# Altium schematic sheet Poactuator_Connectors.SchDoc: Sample Sheet Title
size B; Date: MM/DD/YYYY; Author: Sample Author; Organization: ORGANIZATION; Address1: ADDRESS 1; Address2: ADDRESS 2; Address3: ADDRESS 3; Address4: ADDRESS 4; Revision: -; SheetNumber: 1; SheetTotal: 6; ENG_APP_DATE: --/--/--; DSN_APP_DATE: --/--/--; CHK_APP_DATE: --/--/--
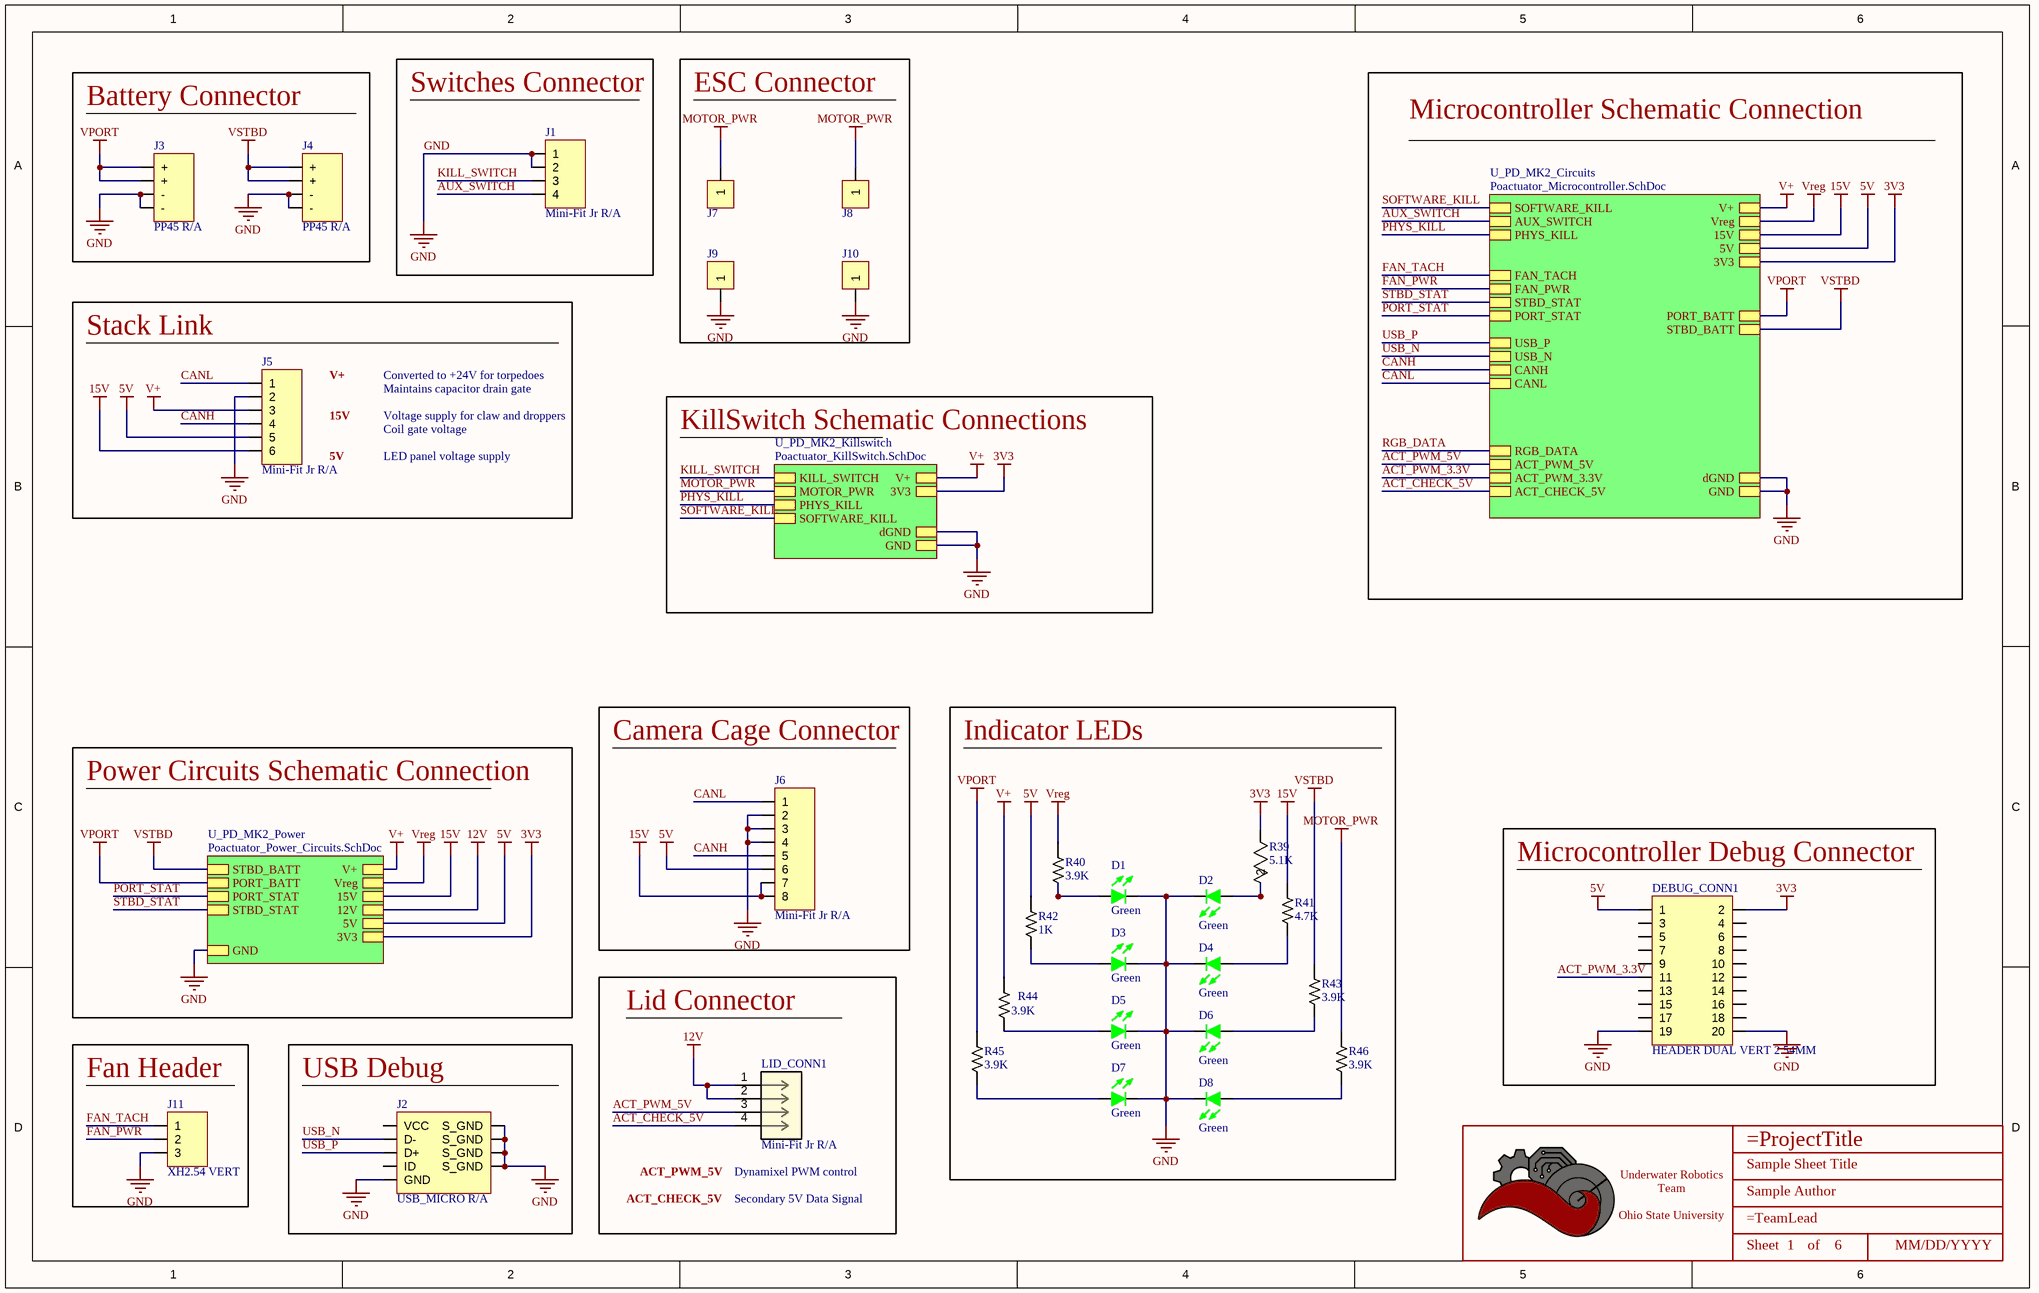
[diagram p0: Poactuator_Connectors.SchDoc]

## Parts
*  Title_Block  [LOGO]  (value not drawn)  (graphical)
D1  Color: Green  [LED_0603]  (hidden comment: IN-S63AT5G)
D2  Color: Green  [LED_0603]  (hidden comment: IN-S63AT5G)
D3  Color: Green  [LED_0603]  (hidden comment: IN-S63AT5G)
D4  Color: Green  [LED_0603]  (hidden comment: IN-S63AT5G)
D5  Color: Green  [LED_0603]  (hidden comment: IN-S63AT5G)
D6  Color: Green  [LED_0603]  (hidden comment: IN-S63AT5G)
D7  Color: Green  [LED_0603]  (hidden comment: IN-S63AT5G)
D8  Color: Green  [LED_0603]  (hidden comment: IN-S63AT5G)
DEBUG_CONN1  HEADER DUAL VERT 2.54MM  [HEADER_2x10PIN_2.54MM]
J1  Mini-Fit Jr R/A  [CONN_MOLEX_MINIFIT JR_4 POS_R/A]
J2  USB_MICRO R/A  [CONN_MINIUSB]
J3  PP45 R/A  [CONN_ANDERSON_PP45_4 POS_R/A]
J4  PP45 R/A  [CONN_ANDERSON_PP45_4 POS_R/A]
J5  Mini-Fit Jr R/A  [CONN_MOLEX_MINIFIT JR_6 POS_R/A]
J6  Mini-Fit Jr R/A  [CONN_MOLEX_MINIFIT JR_8 POS_R/A]
J7  Redcube M4 Term 85A  [Redcube M4 Term 85A]  (value not drawn)
J8  Redcube M4 Term 85A  [Redcube M4 Term 85A]  (value not drawn)
J9  Redcube M4 Term 85A  [Redcube M4 Term 85A]  (value not drawn)
J10  Redcube M4 Term 85A  [Redcube M4 Term 85A]  (value not drawn)
J11  XH2.54 VERT  [CONN_JST_XH254_3POS_VERT]
LID_CONN1  Mini-Fit Jr R/A  [CONN HEADER R/A 4POS 4.2MM]
R39  5.1K  [RC0603N_PAN]
R40  Value  (Ohms): 3.9K  [RESISTOR_0603]  (hidden comment: 3.9k Ohm 5% 1/10W)
R41  Value  (Ohms): 4.7K  [RESISTOR_0603]  (hidden comment: 4.7k Ohm 5% 1/10W)
R42  Value  (Ohms): 1K  [RESISTOR_0603]  (hidden comment: 1k Ohm 5% 1/8W)
R43  Value  (Ohms): 3.9K  [RESISTOR_0603]  (hidden comment: 3.9k Ohm 5% 1/10W)
R44  Value  (Ohms): 3.9K  [RESISTOR_0603]  (hidden comment: 3.9k Ohm 5% 1/10W)
R45  Value  (Ohms): 3.9K  [RESISTOR_0603]  (hidden comment: 3.9k Ohm 5% 1/10W)
R46  Value  (Ohms): 3.9K  [RESISTOR_0603]  (hidden comment: 3.9k Ohm 5% 1/10W)

## Blocks framed on the sheet
Switches Connector: J1
ESC Connector: J7-J10
Battery Connector: J3 J4
Stack Link: J5
Camera Cage Connector: J6
Indicator LEDs: D1-D8 R39-R46
Microcontroller Debug Connector: DEBUG_CONN1
Lid Connector: LID_CONN1
Fan Header: J11
USB Debug: J2

## Sub-sheets
U_PD_MK2_Circuits = Poactuator_Microcontroller.SchDoc: GND, V+, 5V, 3V3, SOFTWARE_KILL, AUX_SWITCH, FAN_TACH, FAN_PWR, 15V, dGND, Vreg, STBD_STAT, PORT_STAT, USB_P, USB_N, STBD_BATT, CANH, CANL, PORT_BATT, RGB_DATA, ACT_PWM_5V, ACT_PWM_3.3V, ACT_CHECK_5V, PHYS_KILL
U_PD_MK2_Killswitch = Poactuator_KillSwitch.SchDoc: KILL_SWITCH, MOTOR_PWR, V+, 3V3, dGND, GND, PHYS_KILL, SOFTWARE_KILL
U_PD_MK2_Power = Poactuator_Power_Circuits.SchDoc: STBD_BATT, PORT_BATT, GND, V+, 15V, 5V, 3V3, PORT_STAT, STBD_STAT, Vreg, 12V

## Nets
3V3: DEBUG_CONN1.2 R39.1 ; sheet U_PD_MK2_Power/3V3, sheet U_PD_MK2_Circuits/3V3, sheet U_PD_MK2_Killswitch/3V3
5V: DEBUG_CONN1.1 J5.5 J6.6 R42.1 ; sheet U_PD_MK2_Power/5V, sheet U_PD_MK2_Circuits/5V
12V: LID_CONN1.1 LID_CONN1.2 ; sheet U_PD_MK2_Power/12V
15V: J5.6 J6.7 J6.8 R41.1 ; sheet U_PD_MK2_Power/15V, sheet U_PD_MK2_Circuits/15V
GND: D1.2 D2.2 D3.2 D4.2 D5.2 D6.2 D7.2 D8.2 DEBUG_CONN1.19 DEBUG_CONN1.20 J1.1 J1.2 J2.5(GND) J2.6(S_GND) J2.7(S_GND) J2.8(S_GND) J2.9(S_GND) J3.3(-) J3.4(-) J4.3(-) J4.4(-) J5.2 J6.2 J6.3 J6.4 J9.1 J10.1 J11.3 ; sheet U_PD_MK2_Power/GND, sheet U_PD_MK2_Circuits/GND, sheet U_PD_MK2_Circuits/dGND, sheet U_PD_MK2_Killswitch/dGND, sheet U_PD_MK2_Killswitch/GND
MOTOR_PWR: J7.1 J8.1 R46.1 ; sheet U_PD_MK2_Killswitch/MOTOR_PWR
V+: J5.3 R44.1 ; sheet U_PD_MK2_Power/V+, sheet U_PD_MK2_Circuits/V+, sheet U_PD_MK2_Killswitch/V+
VPORT: J3.1(+) J3.2(+) R45.1 ; sheet U_PD_MK2_Power/PORT_BATT, sheet U_PD_MK2_Circuits/PORT_BATT
Vreg: R40.1 ; sheet U_PD_MK2_Power/Vreg, sheet U_PD_MK2_Circuits/Vreg
VSTBD: J4.1(+) J4.2(+) R43.1 ; sheet U_PD_MK2_Power/STBD_BATT, sheet U_PD_MK2_Circuits/STBD_BATT
ACT_CHECK_5V: LID_CONN1.4 ; sheet U_PD_MK2_Circuits/ACT_CHECK_5V
ACT_PWM_3.3V: DEBUG_CONN1.11 ; sheet U_PD_MK2_Circuits/ACT_PWM_3.3V
ACT_PWM_5V: LID_CONN1.3 ; sheet U_PD_MK2_Circuits/ACT_PWM_5V
AUX_SWITCH: J1.4 ; sheet U_PD_MK2_Circuits/AUX_SWITCH
CANH: J5.4 J6.5 ; sheet U_PD_MK2_Circuits/CANH
CANL: J5.1 J6.1 ; sheet U_PD_MK2_Circuits/CANL
FAN_PWR: J11.2 ; sheet U_PD_MK2_Circuits/FAN_PWR
FAN_TACH: J11.1 ; sheet U_PD_MK2_Circuits/FAN_TACH
KILL_SWITCH: J1.3 ; sheet U_PD_MK2_Killswitch/KILL_SWITCH
PHYS_KILL: sheet U_PD_MK2_Circuits/PHYS_KILL, sheet U_PD_MK2_Killswitch/PHYS_KILL
PORT_STAT: sheet U_PD_MK2_Power/PORT_STAT, sheet U_PD_MK2_Circuits/PORT_STAT
RGB_DATA: sheet U_PD_MK2_Circuits/RGB_DATA
SOFTWARE_KILL: sheet U_PD_MK2_Circuits/SOFTWARE_KILL, sheet U_PD_MK2_Killswitch/SOFTWARE_KILL
STBD_STAT: sheet U_PD_MK2_Power/STBD_STAT, sheet U_PD_MK2_Circuits/STBD_STAT
USB_N: J2.2(D-) ; sheet U_PD_MK2_Circuits/USB_N
USB_P: J2.3(D+) ; sheet U_PD_MK2_Circuits/USB_P
NetD1_1: D1.1 R40.2
NetD2_1: D2.1 R39.2
NetD3_1: D3.1 R42.2
NetD4_1: D4.1 R41.2
NetD5_1: D5.1 R44.2
NetD6_1: D6.1 R43.2
NetD7_1: D7.1 R45.2
NetD8_1: D8.1 R46.2

Not connected (* = marked no-connect by the designer): DEBUG_CONN1 3 4 5 6 7 8 9 10 12 13 14 15 16 17 18; J2 1(VCC) 4(ID)

## Notes on the sheet
- Microcontroller Schematic Connection
- V+
- 15V
- Converted to +24V for torpedoes
- Voltage supply for claw and droppers
- Coil gate voltage
- Maintains capacitor drain gate
- KillSwitch Schematic Connections
- 5V
- LED panel voltage supply
- Power Circuits Schematic Connection
- ACT_PWM_5V
- (near LID_CONN1) Dynamixel PWM control
- ACT_CHECK_5V
- Secondary 5V Data Signal
- DWG. NO.
- REV.
- SHT.
- THIS DOCUMENT AND THE DATA DISCLOSED HEREIN OR HEREWITH IS THE PROPERTY OF ALTIUM LIMITED AND MAY BE FREELY DISTRIBUTED IN WHOLE. NO RIGHTS ARE RESERVED OR EXPRESS OR IMPLIED WARANTEE GIVEN.
- REVISION
- DESCRIPTION
- DATE
- APPROVED
- ENG:
- APPROVALS
- PROJECT
- DSN:
- CHK:
- REFERENCE DOCUMENTS
- PROJECT REVISION:
- TITLE
- DOCUMENT REVISION:
- DESIGN ITEM:
- BOM:
- FAB DWG:
- PCB DWG:
- ASSY DWG:
- SCALE:
- SIZE
- B
- CAGE CODE
- FILE NAME
- DWG NO.
- SHEET
- OF
- REV
- (in symbol Title_Block) Underwater Robotics Team / Ohio State University; Sheet; of

## Library data of the parts
* = Title_Block: UWRT Schematic Title Block Template / Created June 2021, Dylan Trainor
D1-D8 = LED_Green_0603_3V: LED Green Vf= 3V If = 0.005A / IN-S63AT5G; Made By: Robert Pafford; Forward Current: 5mA; ComponentLink1Description: Datasheet; ComponentLink1URL: https://www.we-online.de/katalog/datasheet/150060GS75000.pdf; Forward Voltage: 3V; Package: 0603; Supplier 1: Digi-Key; Supplier Part Number 1: 1830-1062-1-ND
DEBUG_CONN1 = HEADER_2x10PIN_2.54MM: CONN HEADER VERT 20POS 2.54MM; Made By: Tyson Nguyen; Supplier 1: Digi-Key; Supplier Part Number 1: Z8747-ND
J1 = CONN_MOLEX_MINIFIT JR_4POS_R/A: Molex Minifit Jr. 5569 / 4 Pos R/A Natural; Pitch: 4.2mm; Configuration: Right Angle; Current Per Pin: 13A; Number of Positions: 4; Supplier Part Number 1: WM13112-ND; Supplier 1: Digi-Key; Manufacturer: Molex; Color: Natural; Created By: Flip B; ComponentLink1Description: Datasheet; ComponentLink1URL: https://www.molex.com/pdm_docs/sd/026013115_sd.pdf; Series: Minifit Jr 5569
J2 = CONN_MICROUSB: Amphenol Micro USB-B / USB2.0 5 Pin Right Angle SMD; Pitch: 0.65mm; Current Per Pin: 1.8A; Number of Positions: 5; Manufacturer: Amphenol; Configuration: Right Angle; Color: Silver; Created By: Flip B; ComponentLink1Description: Datasheet; ComponentLink1URL: https://cdn.amphenol-icc.com/media/wysiwyg/files/documentation/datasheet/inputoutput/io_usb_micro.pdf?__cf_chl_jschl_tk__=05693735e19256298f6ef6ca2bb2e65c376a4f56-1625503833-0-Abitsb0-ufjOXJYs_S3J3r2iTn-nObalbmXUksF1VvO_h_WEmRdMlUD1I8-hmWSEVWzY1pirKnrPZWfgY3851qyBZe5ZvnNQePLGIzUgdEIQBVUyW36RsbYpDLEWxJ4horD-5gChFgobLYqwmG5aHl0E8lIn_twwPPrOxilK2gP0q9t_CNOs_u5fMqXvXUrlsOv8tIE2NRlu6NVP8qtkL2GjhlkeTUbDMF8WvvpPDTFOgvZ4Y16Ej8F8AhWos88mo5B1HssXozw0XrkJQIqERITUu6rqloz9kf4ZzhBHtDAt-IkiAFY_Ds9SW8FYKKTtINJVpHZQ6Gyu1FFM4Dc9MO0maE8_mmNcwlxqyRoRk_MPWW8VyByXWM5RSp52jteRKw7FeI9WIYvCbPAOy0Eyib-aseIQsnGbglBcUY6_2xp8GYaJM38H3dNvBPsSOfJBPndKedwKHllxjkucXn6xsN0sDXkpGN-cu8_2bDTJ0g-uUucKSCooYX-ApSDNGpkA_p9zv1SOAD8c0zaZVmtiBsN75QpVz2rzq9_BFxOywPvR; Series: 10118192; Supplier 1: Digi-Key; Supplier Part Number 1: 609-4613-1-ND
J3 J4 = CONN_ANDERSON_2x2_R/A: Anderson PP45 / 4 Pos R/A Red/Black; Pitch: 7.9mm; Configuration: Right Angle; Current Per Pin: 45A; Number of Positions: 4; Manufacturer: Anderson; Color: Red/Black; Created By: Flip B; ComponentLink1Description: Datasheet; ComponentLink1URL: https://www.andersonpower.com/content/dam/app/ecommerce/product-pdfs/DS-PP1545.pdf; Series: PowerPole 45; Supplier 1: Digi-Key; Supplier Part Number 1: 2243-1337G1-ND; Supplier 2: Digi-Key; Supplier Part Number 2: 2243-1336G1-ND; Supplier 3: Digi-Key; Supplier Part Number 3: 2243-1327-BK-ND; Supplier 4: Digi-Key; Supplier Part Number 4: A102007-ND
J5 = CONN_MOLEX_MINIFIT JR_6POS_R/A: Molex Minifit Jr. 5569 / 6 Pos R/A Natural; Pitch: 4.2mm; Configuration: Right Angle; Current Per Pin: 13A; Number of Positions: 8; Manufacturer: Molex; Color: Natural; Created By: Flip B; ComponentLink1Description: Datasheet; ComponentLink1URL: https://www.molex.com/pdm_docs/ps/PS-5556-001.pdf; Series: Minifit Jr 5569; Supplier 1: Digi-Key; Supplier Part Number 1: WM1353-ND
J6 = CONN_MOLEX_MINIFIT JR_8POS_R/A: Molex Minifit Jr. 5569 / 8 Pos R/A Natural; Pitch: 4.2mm; Configuration: Right Angle; Current Per Pin: 13A; Number of Positions: 8; Manufacturer: Molex; Color: Natural; Created By: Flip B; ComponentLink1Description: Datasheet; ComponentLink1URL: https://www.molex.com/pdm_docs/ps/PS-5556-001.pdf; Series: Minifit Jr 5569; Supplier 1: Digi-Key; Supplier Part Number 1: WM1354-ND
J11 = CONN_JST_XH254_3POS_VERT: JST XH 2.54mm Pitch 3 Pos Vertical; Current Per Pin: 4A; Number of Positions: 3; NOTE: Do not use JST 2.5mm parts with this footprint. JST does not make 2.54mm pitch pins, rather only clones make this connector!; Manufacturer: JST; Pitch: 2.54mm; Configuration: Vertical; Color: White; Created By: Robert P; Series: XH 2.54; ComponentLink1Description: Purchase Link; ComponentLink1URL: https://www.amazon.com/460PCS-XH2-54-Connector-Terminal-Connectors/dp/B09DBGVX5C
LID_CONN1 = CONN HEADER R/A 4POS 4.2MM: Mini-Fit Jr Connector Header Through Hole, Right Angle 4 position 0.165" (4.20mm); Manufacturer: Molex; Pitch: 4.2mm; Number of Positions: 4; Max. Current Per Pin: 100mA; Supplier Part Number 1: WM23323-ND; Supplier 1: Digi-Key; Configuration: Right Angle; Color: Natural; Created By: Zach Ramsey; Series: Minifit Jr 5569; ComponentLink2Description: Datasheet; ComponentLink2URL: https://tools.molex.com/pdm_docs/ps/PS-5556-001.pdf
R39 = ERA-3AEB512V_2: 5.1 kOhms ±0.1% 0.1W, 1/10W Chip Resistor 0603 (1608 Metric) Automotive AEC-Q200 Thin Film; Mfr_Name: Panasonic; Copyright: Copyright (C) 2023 Ultra Librarian. All rights reserved.; Manufacturer_Part_Number: ERA-3AEB512V_2; RefDes: RefDes; Type: DEV
R40 R43-R46 = RESISTOR_3.9K_0603: RES 3.9k OHM 1% 1/10W 0603; Tolerance: +/- 1%; Made By: Robert Pafford; Wattage: 1/10W; Supplier 1: Digi-Key; Supplier Part Number 1: P3.90KHCT-ND
R41 = RESISTOR_4.7K_0603: RES 4.7k OHM 5% 1/10W 0603; Tolerance: +/- 5%; Made By: Robert Pafford; Wattage: 1/10W; Supplier: Digikey; Digikey Part Numer: CR0603-JW-104ELFTR-ND; Supplier 1: Digi-Key; Supplier Part Number 1: RMCF0603JT4K70CT-ND
R42 = RESISTOR_1K_0603: RES 1k OHM 5% 1/8W 0603; Tolerance: +/- 5%; Made By: Robert Pafford; ComponentLink1Description: Datasheet; ComponentLink1URL: https://www.bourns.com/docs/product-datasheets/CRxxxxx.pdf; Wattage: 1/8W; Supplier: Digikey; Digikey Part Numer: CR0603-JW-104ELFTR-ND; Supplier 1: Digi-Key; Supplier Part Number 1: 2019-RK73B1JTTD102JCT-ND
J7-J10 = Redcube M4 Term 85A: Created By: Nahtan Ayer; Current Rating: 85 A; Screw Size: M4